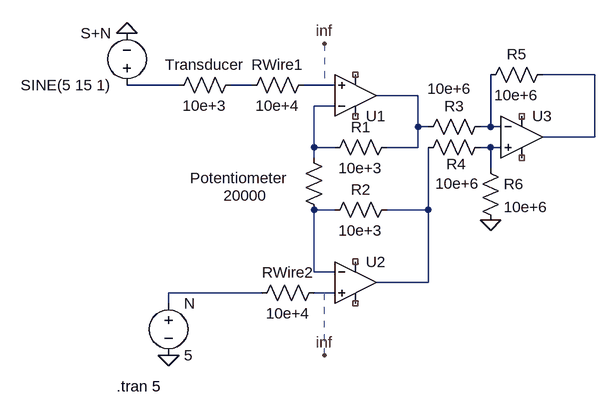
[diagram p0: schematic instrumentation_amplifier.asc]
instrumentation_amplifier.asc, the LTspice schematic file:
Version 4
SHEET 1 880 680
WIRE 592 112 512 112
WIRE -48 128 -128 128
WIRE 64 128 32 128
WIRE 192 128 144 128
WIRE 320 144 256 144
WIRE 192 160 160 160
WIRE 320 192 320 144
WIRE 336 192 320 192
WIRE 432 192 432 112
WIRE 432 192 416 192
WIRE 448 192 432 192
WIRE 592 208 592 112
WIRE 592 208 512 208
WIRE 160 224 160 160
WIRE 192 224 160 224
WIRE 320 224 320 192
WIRE 320 224 272 224
WIRE 432 224 416 224
WIRE 448 224 432 224
WIRE 160 240 160 224
WIRE 432 256 432 224
WIRE 192 320 160 320
WIRE 336 320 336 224
WIRE 336 320 272 320
WIRE 160 416 160 320
WIRE 192 416 160 416
WIRE 336 432 336 320
WIRE 336 432 256 432
WIRE 80 448 -64 448
WIRE 192 448 160 448
WIRE -64 464 -64 448
FLAG -64 544 0
FLAG -128 48 0
FLAG 432 336 0
FLAG 176 544 inf
FLAG 176 64 inf
SYMBOL OpAmps\\UniversalOpAmp1 224 144 M180
SYMATTR InstName U1
SYMBOL OpAmps\\UniversalOpAmp1 224 432 R0
SYMATTR InstName U2
SYMBOL OpAmps\\UniversalOpAmp1 480 208 R0
SYMATTR InstName U3
SYMBOL voltage -128 144 R180
WINDOW 0 24 96 Left 2
WINDOW 3 24 16 Left 2
WINDOW 123 0 0 Left 0
WINDOW 39 0 0 Left 0
SYMATTR InstName S+N
SYMATTR Value SINE(5 15 1)
SYMBOL voltage -64 448 R0
WINDOW 123 0 0 Left 0
WINDOW 39 0 0 Left 0
SYMATTR InstName N
SYMATTR Value 5
SYMBOL res -64 144 R270
WINDOW 0 32 56 VTop 2
WINDOW 3 0 56 VBottom 2
SYMATTR InstName Transducer
SYMATTR Value 10e+3
SYMBOL res 160 112 R90
WINDOW 0 0 56 VBottom 2
WINDOW 3 32 56 VTop 2
SYMATTR InstName RWire1
SYMATTR Value 10e+4
SYMBOL res 176 432 R90
WINDOW 0 0 56 VBottom 2
WINDOW 3 32 56 VTop 2
SYMATTR InstName RWire2
SYMATTR Value 10e+4
SYMBOL res 144 224 R0
WINDOW 0 -175 47 Left 2
WINDOW 3 -123 74 Left 2
SYMATTR InstName Potentiometer
SYMATTR Value 20000
SYMBOL res 288 208 R90
WINDOW 0 0 56 VBottom 2
WINDOW 3 32 56 VTop 2
SYMATTR InstName R1
SYMATTR Value 10e+3
SYMBOL res 432 176 R90
WINDOW 0 0 56 VBottom 2
WINDOW 3 -58 63 VTop 2
SYMATTR InstName R3
SYMATTR Value 10e+6
SYMBOL res 432 208 R90
WINDOW 0 57 53 VBottom 2
WINDOW 3 56 51 VTop 2
SYMATTR InstName R4
SYMATTR Value 10e+6
SYMBOL res 416 240 R0
SYMATTR InstName R6
SYMATTR Value 10e+6
SYMBOL res 528 96 R90
WINDOW 0 0 56 VBottom 2
WINDOW 3 32 56 VTop 2
SYMATTR InstName R5
SYMATTR Value 10e+6
SYMBOL res 288 304 R90
WINDOW 0 0 56 VBottom 2
WINDOW 3 32 56 VTop 2
SYMATTR InstName R2
SYMATTR Value 10e+3
TEXT -144 592 Left 2 !.tran 5
LINE Normal 176 64 176 128 2
LINE Normal 176 544 176 448 2

The netlist it stands for:
* instrumentation_amplifier.asc
XU1 N004 N006 NC_01 NC_02 N005 level1 Avol=1Meg GBW=10Meg Vos=0 En=0 Enk=0 In=0 Ink=0 Rin=500Meg  ; pins In+ In- V+ V- OUT
XU2 N012 N009 NC_03 NC_04 N010 level1 Avol=1Meg GBW=10Meg Vos=0 En=0 Enk=0 In=0 Ink=0 Rin=500Meg  ; pins In+ In- V+ V- OUT
XU3 N008 N007 NC_05 NC_06 N001 level1 Avol=1Meg GBW=10Meg Vos=0 En=0 Enk=0 In=0 Ink=0 Rin=500Meg  ; pins In+ In- V+ V- OUT
V§S+N N002 0 SINE(5 15 1)
V§N N011 0 5
R§Transducer N002 N003 10e+3
RWire1 N004 N003 10e+4
RWire2 N012 N011 10e+4
R§Potentiometer N006 N009 20000
R1 N005 N006 10e+3
R3 N007 N005 10e+6
R4 N008 N010 10e+6
R6 N008 0 10e+6
R5 N001 N007 10e+6
R2 N010 N009 10e+3
.tran 5
.lib UniversalOpAmp1.lib
.backanno
.end